# Altium schematic sheet Full_Power_Board.SchDoc
size A
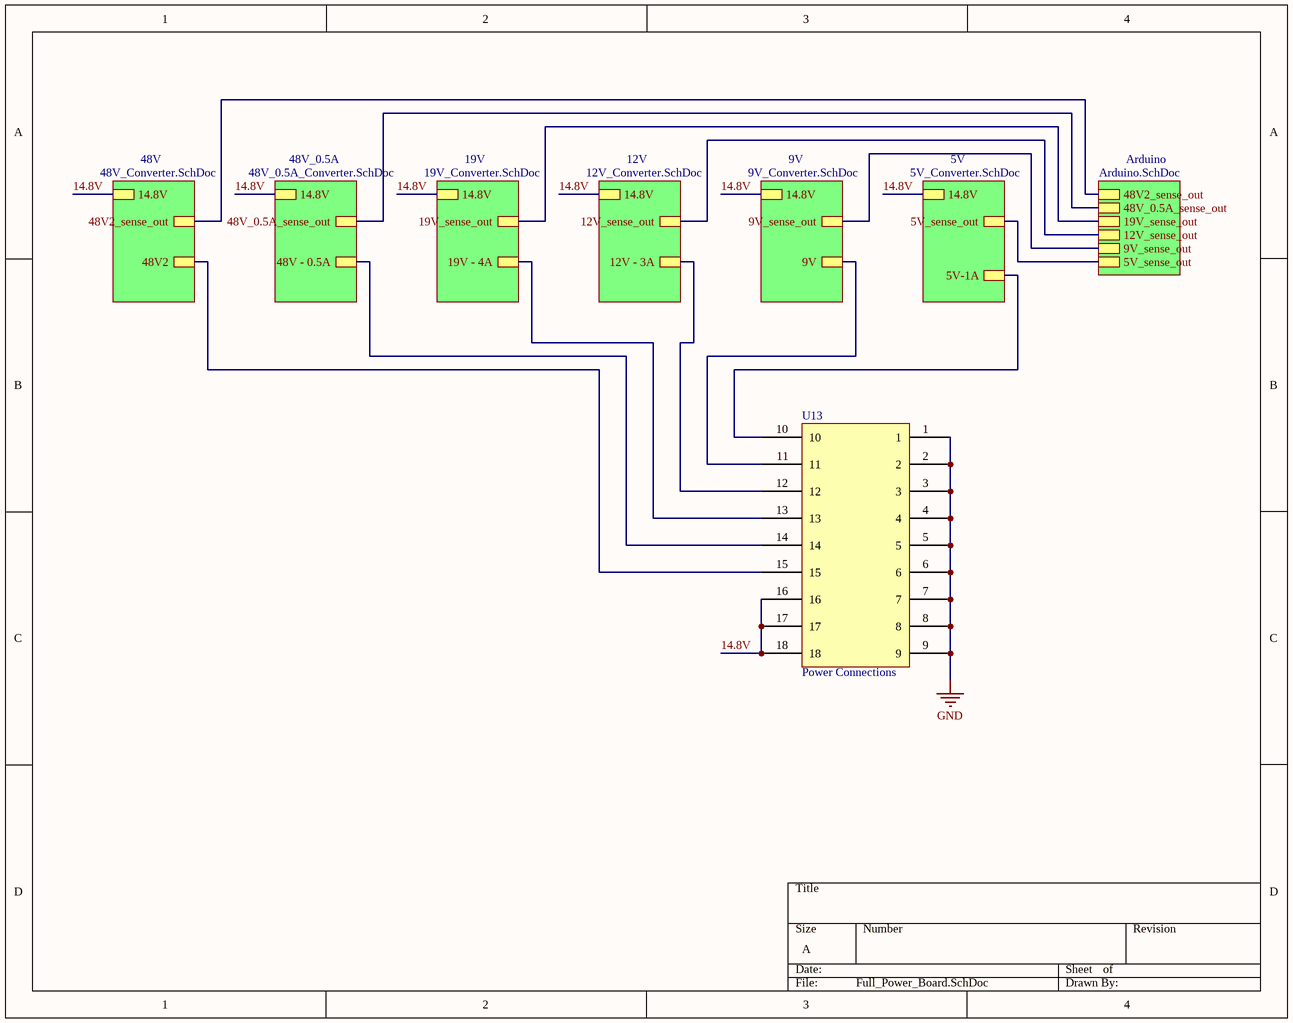
[diagram p0: Full_Power_Board.SchDoc]

## Parts
U13  Power Connections  [Molex Connector]

## Sub-sheets
5V = 5V_Converter.SchDoc: 14.8V, 5V_sense_out, 5V-1A
9V = 9V_Converter.SchDoc: 14.8V, 9V_sense_out, 9V
12V = 12V_Converter.SchDoc: 14.8V, 12V_sense_out, 12V - 3A
19V = 19V_Converter.SchDoc: 14.8V, 19V_sense_out, 19V - 4A
48V = 48V_Converter.SchDoc: 14.8V, 48V2, 48V2_sense_out
48V_0.5A = 48V_0.5A_Converter.SchDoc: 14.8V, 48V - 0.5A, 48V_0.5A_sense_out
Arduino = Arduino.SchDoc: 5V_sense_out, 9V_sense_out, 12V_sense_out, 19V_sense_out, 48V_0.5A_sense_out, 48V2_sense_out

## Nets
GND: U13.1 U13.2 U13.3 U13.4 U13.5 U13.6 U13.7 U13.8 U13.9
14.8V: U13.16 U13.17 U13.18 ; sheet 48V/14.8V, sheet 48V_0.5A/14.8V, sheet 19V/14.8V, sheet 12V/14.8V, sheet 9V/14.8V, sheet 5V/14.8V
NetU13_10: U13.10 ; sheet 5V/5V-1A
NetU13_11: U13.11 ; sheet 9V/9V
NetU13_12: U13.12 ; sheet 12V/12V - 3A
NetU13_13: U13.13 ; sheet 19V/19V - 4A
NetU13_14: U13.14 ; sheet 48V_0.5A/48V - 0.5A
NetU13_15: U13.15 ; sheet 48V/48V2
(unnamed): sheet 48V/48V2_sense_out, sheet Arduino/48V2_sense_out
(unnamed): sheet 48V_0.5A/48V_0.5A_sense_out, sheet Arduino/48V_0.5A_sense_out
(unnamed): sheet 19V/19V_sense_out, sheet Arduino/19V_sense_out
(unnamed): sheet 12V/12V_sense_out, sheet Arduino/12V_sense_out
(unnamed): sheet 9V/9V_sense_out, sheet Arduino/9V_sense_out
(unnamed): sheet 5V/5V_sense_out, sheet Arduino/5V_sense_out

## Library data of the parts
U13 = Molex Connector